# Altium schematic sheet QT7_Xplained_Pro.SchDoc
size B
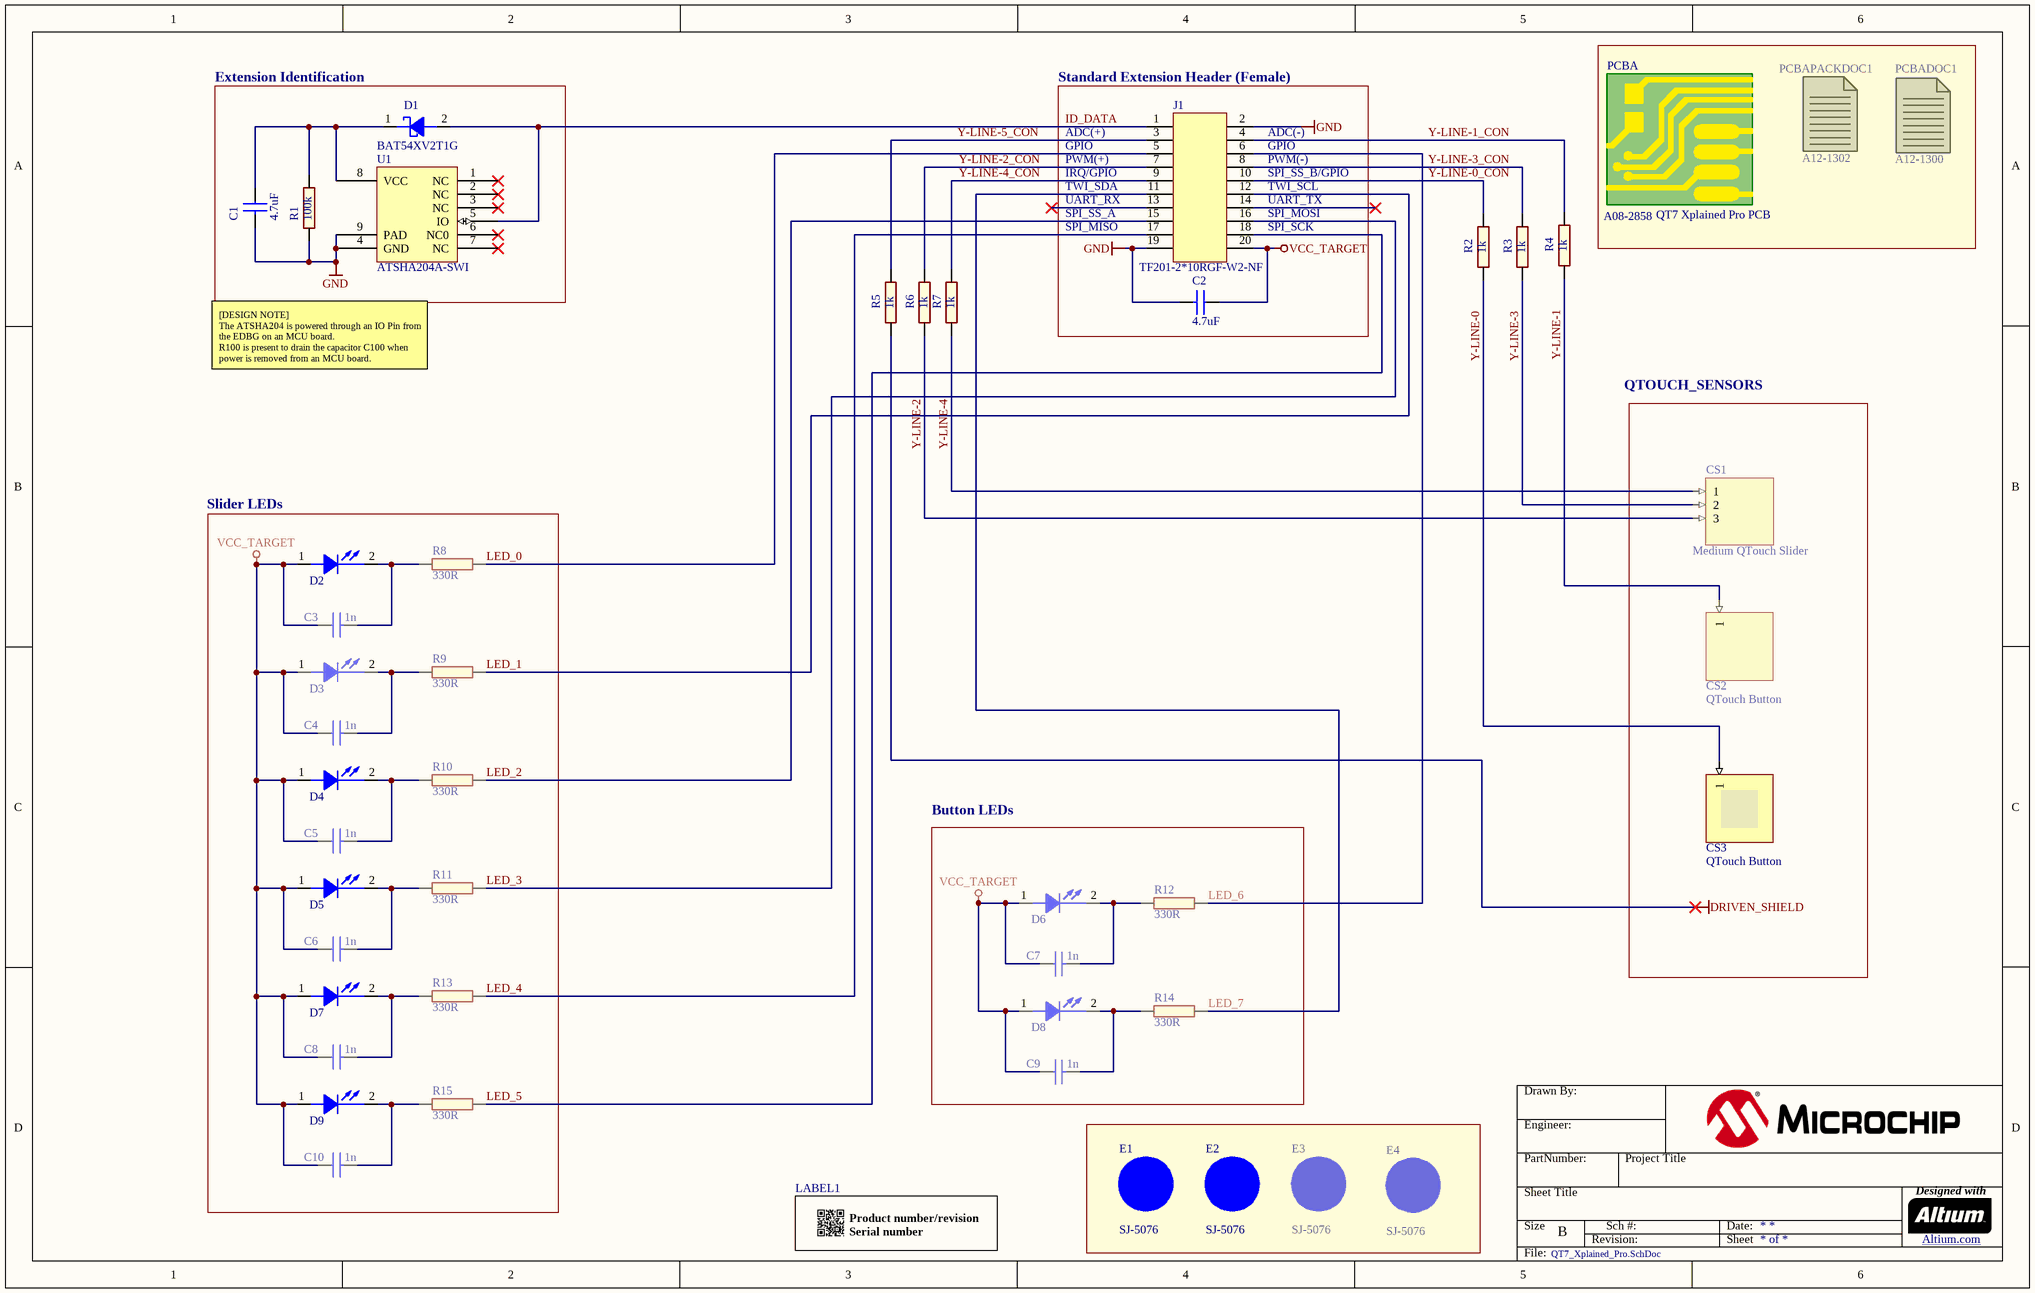
[diagram p0: QT7_Xplained_Pro.SchDoc]

## Parts
?  (no value)  (graphical)
C1  value 4.7uF  [AP1-00001]  (hidden comment: Recommended by Escatec. No datasheet available yet.)
C2  value 4.7uF  [AP1-00001]  (hidden comment: Recommended by Escatec. No datasheet available yet.)
C3  value 1n  [AP1-00001]  (hidden comment: CAP-NONPOL)
C4  value 1n  [AP1-00001]  (hidden comment: CAP-NONPOL)
C5  value 1n  [AP1-00001]  (hidden comment: CAP-NONPOL)
C6  value 1n  [AP1-00001]  (hidden comment: CAP-NONPOL)
C7  value 1n  [AP1-00001]  (hidden comment: CAP-NONPOL)
C8  value 1n  [AP1-00001]  (hidden comment: CAP-NONPOL)
C9  value 1n  [AP1-00001]  (hidden comment: CAP-NONPOL)
C10  value 1n  [AP1-00001]  (hidden comment: CAP-NONPOL)
CS1  Medium QTouch Slider  [Selfcap_Slider]  (no BOM)
CS2  QTouch Button  [PCBComponent_1]  (no BOM)
CS3  QTouch Button  [PCBComponent_1]  (no BOM)
D1  value BAT54XV2T1G  [AP4-00036]  (hidden comment: Farnell# 1615809)
D2  LED_21  [AP4-00034]  (value not drawn)
D3  LED_21  [AP4-00034]  (value not drawn)
D4  LED_21  [AP4-00034]  (value not drawn)
D5  LED_21  [AP4-00034]  (value not drawn)
D6  LED_21  [AP4-00034]  (value not drawn)
D7  LED_21  [AP4-00034]  (value not drawn)
D8  LED_21  [AP4-00034]  (value not drawn)
D9  LED_21  [AP4-00034]  (value not drawn)
E1  value SJ-5076  [AP8-00192]
E2  value SJ-5076  [AP8-00192]
E3  value SJ-5076  [AP8-00192]
E4  value SJ-5076  [AP8-00192]
J1  value TF201-2*10RGF-W2-NF  [AP8-00621]
LABEL1  (no value)  [AP8-00317]
PCBA  value QT7 Xplained Pro PCB  AN: A08-2858  (hidden comment: PCB)  (mechanical)
PCBADOC1  AN: A12-1300  (hidden comment: PCBADOC)  (mechanical)
PCBAPACKDOC1  AN: A12-1302  (hidden comment: PCBADOC)  (mechanical)
R1  value 100k  [AP2-00000]  (hidden comment: R2)
R2  value 1k  [AP2-00000]  (hidden comment: R2)
R3  value 1k  [AP2-00000]  (hidden comment: R2)
R4  value 1k  [AP2-00000]  (hidden comment: R2)
R5  value 1k  [AP2-00000]  (hidden comment: R2)
R6  value 1k  [AP2-00000]  (hidden comment: R2)
R7  value 1k  [AP2-00000]  (hidden comment: R2)
R8  value 330R  [AP2-00000]  (hidden comment: R2)
R9  value 330R  [AP2-00000]  (hidden comment: R2)
R10  value 330R  [AP2-00000]  (hidden comment: R2)
R11  value 330R  [AP2-00000]  (hidden comment: R2)
R12  value 330R  [AP2-00000]  (hidden comment: R2)
R13  value 330R  [AP2-00000]  (hidden comment: R2)
R14  value 330R  [AP2-00000]  (hidden comment: R2)
R15  value 330R  [AP2-00000]  (hidden comment: R2)
U1  ATSHA204A-SWI  [AP6-00409]

## Blocks framed on the sheet
Extension Identification: C1 D1 R1 U1
Standard Extension Header (Female): C2 J1
Slider LEDs: C3-C6 C8 C10 D2-D5 D7 D9 R8-R11 R13 R15
Button LEDs: C7 C9 D6 D8 R12 R14

## Nets
DRIVEN_SHIELD: R5.1
GND: C1.2 C2.2 J1.2 J1.19 R1.1 U1.4(GND) U1.9(PAD)
VCC_TARGET: C2.1 C3.1 C4.1 C5.1 C6.1 C7.1 C8.1 C9.1 C10.1 D2.1(ANODE) D3.1(ANODE) D4.1(ANODE) D5.1(ANODE) D6.1(ANODE) D7.1(ANODE) D8.1(ANODE) D9.1(ANODE) J1.20
ID_DATA: D1.2(ANODE) J1.1 U1.5(IO)
LED_0: J1.5 R8.1
LED_1: J1.12 R9.1
LED_2: J1.15 R10.1
LED_3: J1.16 R11.1
LED_4: J1.17 R13.1
LED_5: J1.18 R15.1
LED_6: J1.6 R12.1
LED_7: J1.11 R14.1
Y-LINE-0: CS3.1 R2.1
Y-LINE-0_CON: J1.10 R2.2
Y-LINE-1: CS2.1 R4.1
Y-LINE-1_CON: J1.4 R4.2
Y-LINE-2: CS1.3 R6.1
Y-LINE-2_CON: J1.7 R6.2
Y-LINE-3: CS1.2 R3.1
Y-LINE-3_CON: J1.8 R3.2
Y-LINE-4: CS1.1 R7.1
Y-LINE-4_CON: J1.9 R7.2
Y-LINE-5_CON: J1.3 R5.2
NetC1_1: C1.1 D1.1(CATHODE) R1.2 U1.8(VCC)
NetC3_2: C3.2 D2.2(CATHODE) R8.2
NetC4_2: C4.2 D3.2(CATHODE) R9.2
NetC5_2: C5.2 D4.2(CATHODE) R10.2
NetC6_2: C6.2 D5.2(CATHODE) R11.2
NetC7_2: C7.2 D6.2(CATHODE) R12.2
NetC8_2: C8.2 D7.2(CATHODE) R13.2
NetC9_2: C9.2 D8.2(CATHODE) R14.2
NetC10_2: C10.2 D9.2(CATHODE) R15.2

Not connected (* = marked no-connect by the designer): E1 1(FIDUCIAL); E2 1(FIDUCIAL); E3 1(FIDUCIAL); E4 1(FIDUCIAL); J1 13* 14*; U1 1(NC)* 2(NC)* 3(NC)* 6(NC0)* 7(NC)*

## Notes on the sheet
- ADC(+)
- PWM(+)
- GPIO
- (near J1) GPIO
- (near J1) ADC(-)
- (near J1) PWM(-)
- TWI_SDA
- UART_RX
- SPI_SS_A
- SPI_MISO
- IRQ/GPIO
- (near J1) TWI_SCL
- (near J1) UART_TX
- (near J1) SPI_MOSI
- (near J1) SPI_SCK
- (near J1) SPI_SS_B/GPIO
- [DESIGN NOTE]
  The ATSHA204 is powered through an IO Pin from the EDBG on an MCU board.
  R100 is present to drain the capacitor C100 when power is removed from an MCU board.
- QTOUCH_SENSORS
- Drawn By:
- Engineer:
- PartNumber:
- Project Title
- Sheet Title
- Size
- B
- Revision:
- Sch #:
- Date:
- Sheet
- Designed with
- Altium.com <http://go.altium.com/MicrochipLandingPage_Evaluation.html>
- File:
- (in symbol A09-0611) / Product number/revision / Serial number

## Library data of the parts
? = Title Block B
C1 C2 = A01-0347: Ceramic capacitor, SMD 0402, X5R, 6.3V, +/-20% (de33687); PartGroup: Capacitors,Ceramic,SMD 0402; Manufacturer: Murata; MPN: GRM155R60J475ME87D; Tolerance: +-20%; TemperatureRange: -55°C to +85°C; ComponentStatus: 'Active (verified)'; Status: Active; Verified by: Lars Helge Mo; Verified date: 2005-12-15; AN: A01-0347; Height: 0,5; FootprintStatus: 'Active (Verified)'
C3-C10 = A01-0038: Ceramic capacitor, SMD 0402, X7R, 50V, +/-10%; PartGroup: Capacitors,Ceramic,SMD 0402; TemperatureRange: -55 - +125 deg C; ComponentStatus: 'Active (verified)'; Status: Active; Verified by: Lars Helge Mo; Verified date: 2005-12-15; AN: A01-0038; Tolerance: 50V, +/-10%; Height: 0.550000011920929; FootprintStatus: 'Active (Verified)'
CS1 = MediumQTouchSlider: ConfiguratorName: ATMEL_TOUCH; ConfigurationParameters: {}__sensorid[4]{}width[50]{}height[12]{}gapthickness[0.3]{}
CS2 CS3 = QTouchButton: ConfiguratorName: ATMEL_TOUCH; ConfigurationParameters: {}__sensorid[1]{}width[8]{}height[8]{}
D1 = A04-0049: Schottky diode, If:200mA, Vf:0.35V, Vrrm:30V, SOD-523; PartGroup: Diodes,Schottky; Manufacturer: ON Semiconductor; TemperatureRange: -55°C to +125°C; ComponentStatus: 'Active (verified)'; Verified date: 2006-02-07; Verified by: Ketil Skjerve; Status: Active; AN: A04-0049; Height: 0,699999988079071; MPN: BAT54XV2T1G; FootprintStatus: 'Active (Verified)'
D2-D9 = A10-0148: Reverse mount SMD White LED 180-450mcd@20mA; PartGroup: Opto,LEDs,SMD; Manufacturer: Lite-On Technology Corp.; Value: LTW-C230DS; TemperatureRange: -30 to +85 C; ComponentStatus: 'Active (verified)'; Status: New; AN: A10-0148; MPN: LTW-C230DS; FootprintStatus: 'Active (Verified)'
E1-E4 = A08-0053: 2.8mm adhesive feet,diam 8.0mm; PartGroup: Mechanical devices,Mounting accessories; Manufacturer: 3M; Status: Active; AN: A08-0053; Height: 2,79999995231628; MPN: SJ-5076
J1 = A08-1512: 2x10, female pin header receptable, right-angled, 2.54mm pitch, THM, Pin In Paste; PartGroup: Mechanical devices,Connectors,Pin header receptacle; MPN: F201-2*10RGF-W2-NF; Manufacturer: Pro-data International Corp; ComponentStatus: 'Active (verified)'; AN: A08-1512; Height: 5,07999992370605; FootprintStatus: 'New (Not verified)'
LABEL1 = A09-0611: PCBA identification label PP Top White Gloss; PartGroup: Mechanical devices,Packaging materials,Printed Labels; Manufacturer: ACT Logimark AS; MPN: 505462; Status: New; AN: A09-0611
PCBA = A08-2858: QT7 Xplained Pro extension kit PCB Gerber files. Variant 1; PartGroup: Mechanical devices,Printed circuit boards; ComponentStatus: 'Active (verified)'
PCBADOC1 = A12-1300: QT7 Xplained pro extension kit PCBA Documentation; PartGroup: Documentation,PCBA Documents,Atmel; Value: A09-3091 PCBA Files; ComponentStatus: 'Active (verified)'
PCBAPACKDOC1 = A12-1302: How to pack QT7 Xplained Pro; PartGroup: Documentation,Procedures,Packaging Instructions; Value: QT7 Xplained Pro packaging instructions; ComponentStatus: 'Active (verified)'
R1 = A02-0260: Thick film resistor, SMD 0402, 1/16W, 1%; PartGroup: Resistors,SMD,0402 1%; TemperatureRange: -55 - +125 deg C; ComponentStatus: 'Active (verified)'; Status: Active; Verified by: Lars Helge Mo; Verified date: 2005-12-19; AN: A02-0260; Tolerance: 1 %; Height: 0,349999994039536; FootprintStatus: 'Active (Verified)'
R2-R7 = A02-0212: Thick film resistor, SMD 0402, 1/16W, 1%; PartGroup: Resistors,SMD,0402 1%; TemperatureRange: -55 - +125 deg C; ComponentStatus: 'Active (verified)'; Status: Active; Verified by: Lars Helge Mo; Verified date: 2005-12-19; AN: A02-0212; Tolerance: 1 %; Height: 0.349999994039536; FootprintStatus: 'Active (Verified)'
R8-R15 = A02-0200: Thick film resistor, SMD 0402, 1/16W, 1%; PartGroup: Resistors,SMD,0402 1%; TemperatureRange: -55 - +125 deg C; ComponentStatus: 'Active (verified)'; Status: Active; Verified by: Lars Helge Mo; Verified date: 2005-12-19; AN: A02-0200; Tolerance: 1 %; Height: 0.349999994039536; FootprintStatus: 'Active (Verified)'
U1 = A06-1276: ATSHA204 with 1-wire interface and UDFN8 package; PartGroup: Integrated Circuits,Special function,Encryption; Manufacturer: ATMEL; MPN: ATSHA204A-MAHCZ-T; Value: ATSHA204 SWI UDFN8; ComponentStatus: 'New (not verified)'; Status: New; AN: A06-1276; Height: 0.600000023841858; FootprintStatus: 'Active (Verified)'